# Altium schematic sheet ZIF_to_2xZIF.SchDoc
size 368 x 215 mm
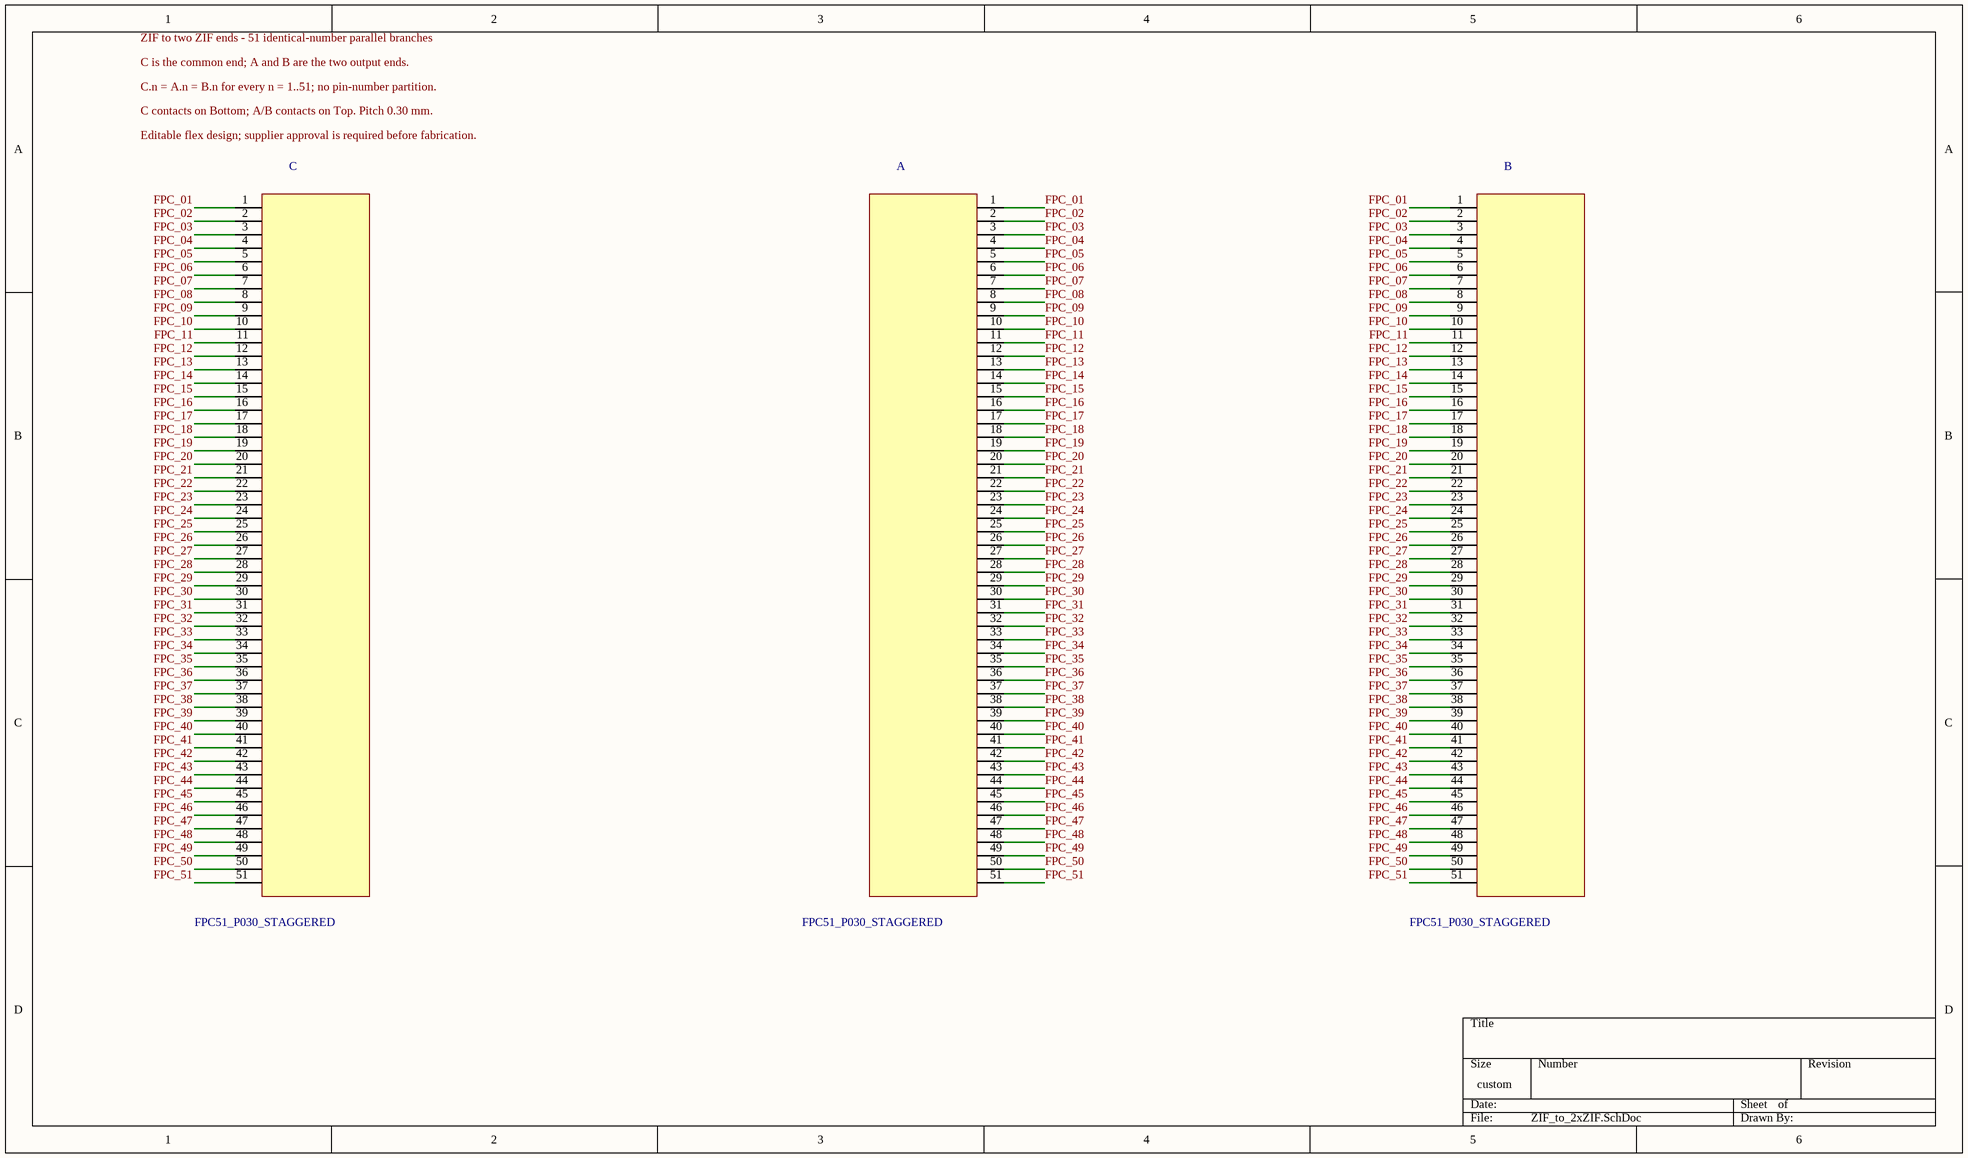
[diagram p0: ZIF_to_2xZIF.SchDoc]

## Parts
A  FPC51_P030_STAGGERED  [FPC51_P030_STAGGERED]
B  FPC51_P030_STAGGERED  [FPC51_P030_STAGGERED]
C  FPC51_P030_STAGGERED  [FPC51_P030_STAGGERED]

## Nets
FPC_01: A.1 B.1 C.1
FPC_02: A.2 B.2 C.2
FPC_03: A.3 B.3 C.3
FPC_04: A.4 B.4 C.4
FPC_05: A.5 B.5 C.5
FPC_06: A.6 B.6 C.6
FPC_07: A.7 B.7 C.7
FPC_08: A.8 B.8 C.8
FPC_09: A.9 B.9 C.9
FPC_10: A.10 B.10 C.10
FPC_11: A.11 B.11 C.11
FPC_12: A.12 B.12 C.12
FPC_13: A.13 B.13 C.13
FPC_14: A.14 B.14 C.14
FPC_15: A.15 B.15 C.15
FPC_16: A.16 B.16 C.16
FPC_17: A.17 B.17 C.17
FPC_18: A.18 B.18 C.18
FPC_19: A.19 B.19 C.19
FPC_20: A.20 B.20 C.20
FPC_21: A.21 B.21 C.21
FPC_22: A.22 B.22 C.22
FPC_23: A.23 B.23 C.23
FPC_24: A.24 B.24 C.24
FPC_25: A.25 B.25 C.25
FPC_26: A.26 B.26 C.26
FPC_27: A.27 B.27 C.27
FPC_28: A.28 B.28 C.28
FPC_29: A.29 B.29 C.29
FPC_30: A.30 B.30 C.30
FPC_31: A.31 B.31 C.31
FPC_32: A.32 B.32 C.32
FPC_33: A.33 B.33 C.33
FPC_34: A.34 B.34 C.34
FPC_35: A.35 B.35 C.35
FPC_36: A.36 B.36 C.36
FPC_37: A.37 B.37 C.37
FPC_38: A.38 B.38 C.38
FPC_39: A.39 B.39 C.39
FPC_40: A.40 B.40 C.40
FPC_41: A.41 B.41 C.41
FPC_42: A.42 B.42 C.42
FPC_43: A.43 B.43 C.43
FPC_44: A.44 B.44 C.44
FPC_45: A.45 B.45 C.45
FPC_46: A.46 B.46 C.46
FPC_47: A.47 B.47 C.47
FPC_48: A.48 B.48 C.48
FPC_49: A.49 B.49 C.49
FPC_50: A.50 B.50 C.50
FPC_51: A.51 B.51 C.51

## Notes on the sheet
- ZIF to two ZIF ends - 51 identical-number parallel branches
- C is the common end; A and B are the two output ends.
- C.n = A.n = B.n for every n = 1..51; no pin-number partition.
- C contacts on Bottom; A/B contacts on Top. Pitch 0.30 mm.
- Editable flex design; supplier approval is required before fabrication.

## Library data of the parts
A B C = FPC51_P030_STAGGERED: Integral FPC contact array